# Altium schematic sheet Sheet1.SchDoc
size A4; SheetNumber: 1; SheetTotal: 1
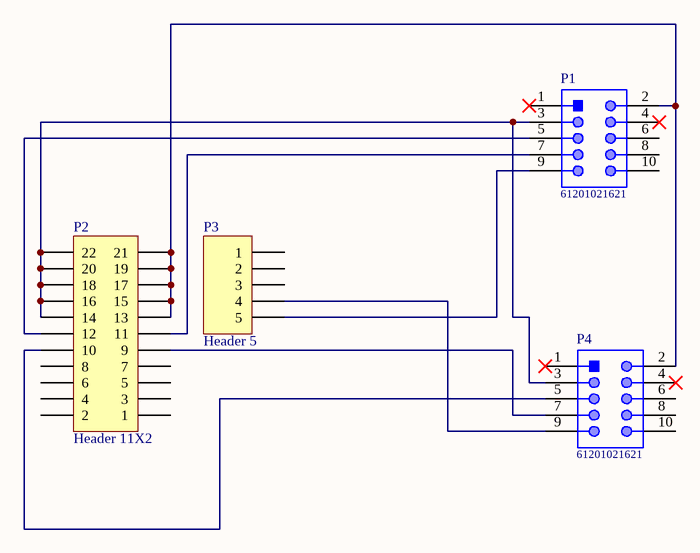
[diagram p0: Sheet1.SchDoc]

## Parts
P1  61201021621  [61201021621]
P2  Header 11X2  [HDR2X11]
P3  Header 5  [HDR1X5]
P4  61201021621  [61201021621]

## Nets
NetP1_2: P1.2 P2.13 P2.15 P2.17 P2.19 P2.21 P4.2
NetP1_3: P1.3 P2.14 P2.16 P2.18 P2.20 P2.22 P4.3
NetP1_5: P1.5 P2.12
NetP1_7: P1.7 P2.11
NetP1_9: P1.9 P3.5
NetP2_9: P2.9 P4.7
NetP2_10: P2.10 P4.5
NetP3_4: P3.4 P4.9

Not connected (* = marked no-connect by the designer): P1 1* 4* 6 8 10; P2 1 2 3 4 5 6 7 8; P3 1 2 3; P4 1* 4* 6 8 10

## Library data of the parts
P1 P4 = CMP-1502-00007-1: Male Box Header WR-BHD, THT, Vertical, pitch 2.54 mm, 10 pins; Manufacturer: Wurth Elektronik; Contact Resistance: 20mOhm; Withstanding Voltage: 500VAC; Pin Number: 10; Working Voltage: 250VAC; Pitch: 2.54mm; Mounting Technology: THT; Operating Temperature: -40to125degC; Published Date: August2018; Gender: Male; Packaging: Tray; Manufacturer URL: http://www.we-online.de; Datasheet URL: https://katalog.we-online.de/em/datasheet/6120xx21621.pdf; Orientation: Vertical; Package Reference: 61201021621; Part Number: 61201021621; Publisher: WurthElektronik
P2 = Header 11X2: Header, 11-Pin, Dual row; LatestRevisionDate: 17-Jul-2002; LatestRevisionNote: Re-released for DXP Platform.; Publisher: Altium Limited
P3 = Header 5: Header, 5-Pin; LatestRevisionDate: 17-Jul-2002; LatestRevisionNote: Re-released for DXP Platform.; Publisher: Altium Limited